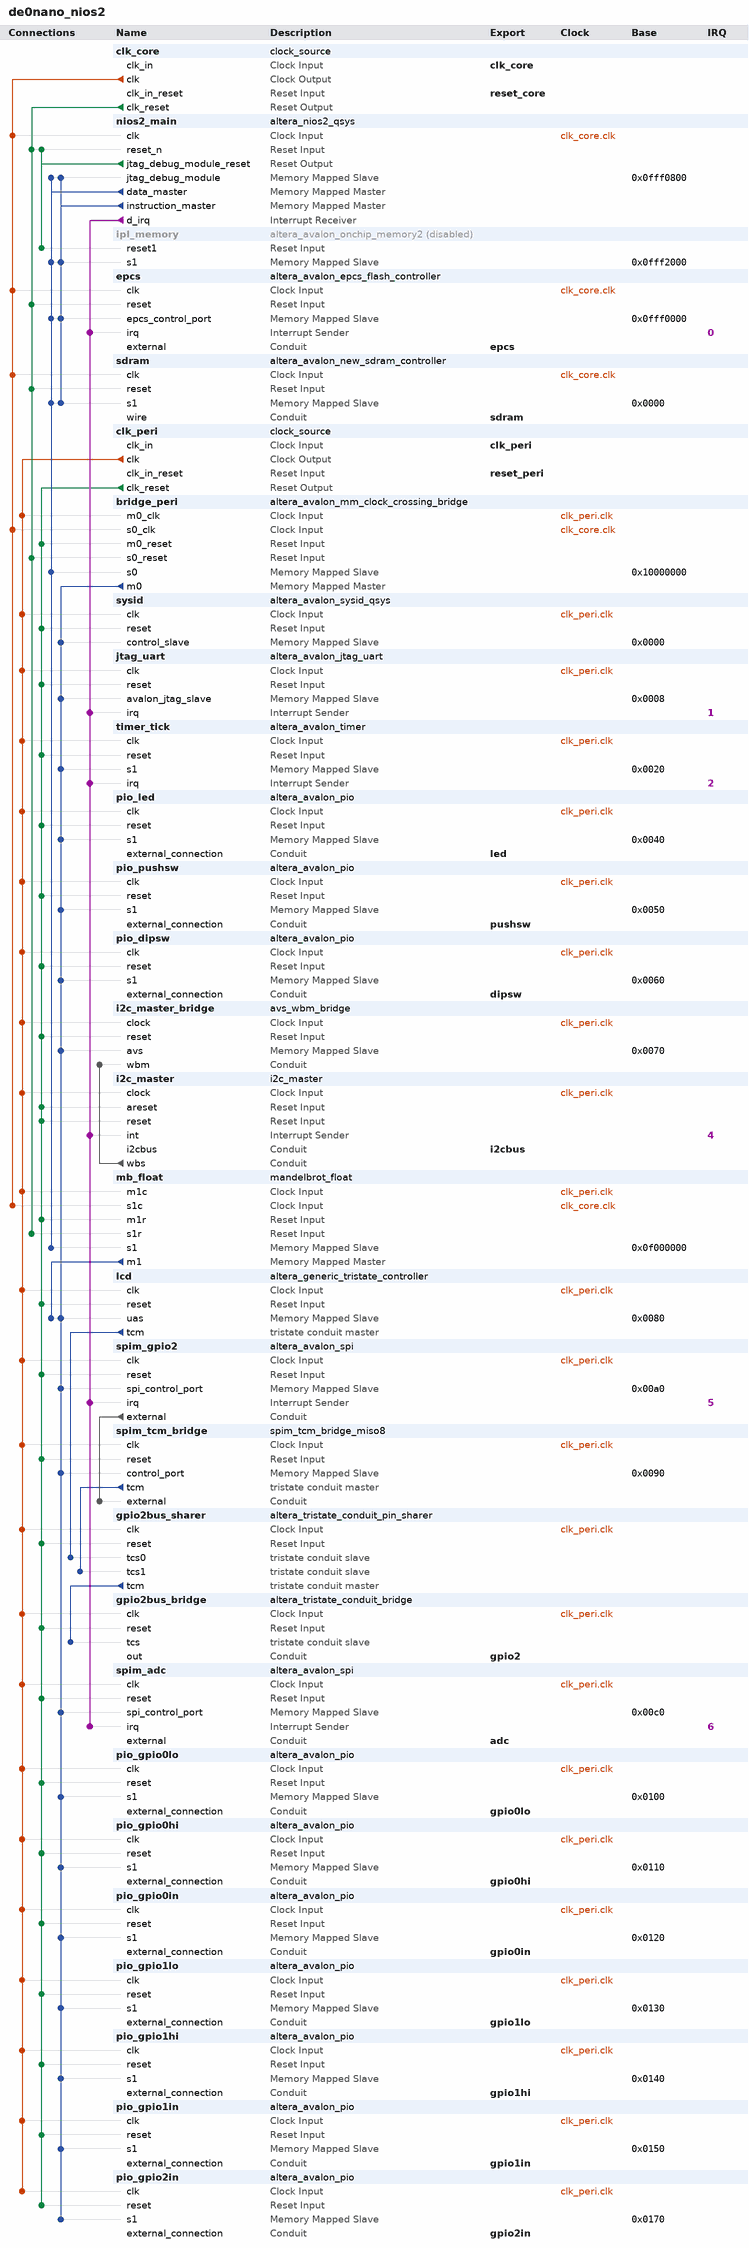
[diagram p0: system contents]
# Platform Designer (Qsys) system de0nano_nios2, Cyclone IV E EP4CE22F17C6
# Parameters at their usual value, and those the tool derives, are not listed.
package require -exact qsys 13.0.1.99.2
create_system de0nano_nios2
set_project_property DEVICE_FAMILY {Cyclone IV E}
set_project_property DEVICE EP4CE22F17C6

add_instance clk_core clock_source 13.0
set_instance_parameter_value clk_core clockFrequency 133333333

add_instance nios2_main altera_nios2_qsys 13.0
set_instance_parameter_value nios2_main resetSlave epcs.epcs_control_port
set_instance_parameter_value nios2_main mmu_TLBMissExcSlave None
set_instance_parameter_value nios2_main exceptionSlave sdram.s1
set_instance_parameter_value nios2_main breakSlave nios2_main.jtag_debug_module
set_instance_parameter_value nios2_main impl Tiny
set_instance_parameter_value nios2_main icache_size 4096

add_instance ipl_memory altera_avalon_onchip_memory2 13.0.1.99.2
set_instance_property ipl_memory ENABLED false
set_instance_parameter_value ipl_memory allowInSystemMemoryContentEditor true
set_instance_parameter_value ipl_memory dataWidth 32
set_instance_parameter_value ipl_memory dualPort false
set_instance_parameter_value ipl_memory initMemContent true
set_instance_parameter_value ipl_memory initializationFileName /home/shuta/projects/shinonome/demo/de0nano_nios2_ipl_memory.hex
set_instance_parameter_value ipl_memory instanceID IPL
set_instance_parameter_value ipl_memory memorySize 8192
set_instance_parameter_value ipl_memory useNonDefaultInitFile true

add_instance epcs altera_avalon_epcs_flash_controller 13.0.1.99.2

add_instance sdram altera_avalon_new_sdram_controller 13.0.1.99.2
set_instance_parameter_value sdram TAC 5.4
set_instance_parameter_value sdram TRCD 18.0
set_instance_parameter_value sdram TRFC 60.0
set_instance_parameter_value sdram TRP 18.0
set_instance_parameter_value sdram casLatency 3
set_instance_parameter_value sdram columnWidth 9
set_instance_parameter_value sdram dataWidth 16
set_instance_parameter_value sdram generateSimulationModel false
set_instance_parameter_value sdram initRefreshCommands 8
set_instance_parameter_value sdram model single_Micron_MT48LC4M32B2_7_chip
set_instance_parameter_value sdram numberOfBanks 4
set_instance_parameter_value sdram numberOfChipSelects 1
set_instance_parameter_value sdram powerUpDelay 200.0
set_instance_parameter_value sdram refreshPeriod 7.8125
set_instance_parameter_value sdram rowWidth 13

add_instance clk_peri clock_source 13.0
set_instance_parameter_value clk_peri clockFrequency 40000000

add_instance bridge_peri altera_avalon_mm_clock_crossing_bridge 13.0
set_instance_parameter_value bridge_peri DATA_WIDTH 32
set_instance_parameter_value bridge_peri ADDRESS_WIDTH 11
set_instance_parameter_value bridge_peri MAX_BURST_SIZE 1
set_instance_parameter_value bridge_peri COMMAND_FIFO_DEPTH 4
set_instance_parameter_value bridge_peri RESPONSE_FIFO_DEPTH 4
set_instance_parameter_value bridge_peri MASTER_SYNC_DEPTH 2
set_instance_parameter_value bridge_peri SLAVE_SYNC_DEPTH 2

add_instance sysid altera_avalon_sysid_qsys 13.0
set_instance_parameter_value sysid id 0

add_instance jtag_uart altera_avalon_jtag_uart 13.0.1.99.2
set_instance_parameter_value jtag_uart simInteractiveOptions NO_INTERACTIVE_WINDOWS

add_instance timer_tick altera_avalon_timer 13.0.1.99.2
set_instance_parameter_value timer_tick alwaysRun true
set_instance_parameter_value timer_tick fixedPeriod true
set_instance_parameter_value timer_tick period 1
set_instance_parameter_value timer_tick periodUnits MSEC
set_instance_parameter_value timer_tick snapshot false

add_instance pio_led altera_avalon_pio 13.0.1.99.2
set_instance_parameter_value pio_led direction Output
set_instance_parameter_value pio_led width 8

add_instance pio_pushsw altera_avalon_pio 13.0.1.99.2
set_instance_parameter_value pio_pushsw direction Input
set_instance_parameter_value pio_pushsw simDoTestBenchWiring true
set_instance_parameter_value pio_pushsw simDrivenValue 3
set_instance_parameter_value pio_pushsw width 2

add_instance pio_dipsw altera_avalon_pio 13.0.1.99.2
set_instance_parameter_value pio_dipsw direction Input
set_instance_parameter_value pio_dipsw simDoTestBenchWiring true
set_instance_parameter_value pio_dipsw simDrivenValue 15
set_instance_parameter_value pio_dipsw width 4

add_instance i2c_master_bridge avs_wbm_bridge 1.0
set_instance_parameter_value i2c_master_bridge ADDR_WIDTH 3
set_instance_parameter_value i2c_master_bridge WORD_WIDTH 8

add_instance i2c_master i2c_master 1.0

add_instance mb_float mandelbrot_float 1.0
set_instance_parameter_value mb_float LCD_BASE 128
set_instance_parameter_value mb_float ITER_WIDTH 8

add_instance lcd altera_generic_tristate_controller 13.0
set_instance_parameter_value lcd TCM_ADDRESS_W 1
set_instance_parameter_value lcd TCM_DATA_W 8
set_instance_parameter_value lcd TCM_BYTEENABLE_W 1
set_instance_parameter_value lcd TCM_READ_WAIT 150
set_instance_parameter_value lcd TCM_WRITE_WAIT 50
set_instance_parameter_value lcd TCM_SETUP_WAIT 25
set_instance_parameter_value lcd TCM_DATA_HOLD 25
set_instance_parameter_value lcd TCM_MAX_PENDING_READ_TRANSACTIONS 1
set_instance_parameter_value lcd TCM_TURNAROUND_TIME 50
set_instance_parameter_value lcd TCM_TIMING_UNITS 0
set_instance_parameter_value lcd TCM_READLATENCY 2
set_instance_parameter_value lcd TCM_SYMBOLS_PER_WORD 1
set_instance_parameter_value lcd USE_READ 1
set_instance_parameter_value lcd USE_BEGINTRANSFER 0
set_instance_parameter_value lcd USE_BYTEENABLE 0
set_instance_parameter_value lcd USE_OUTPUTENABLE 0
set_instance_parameter_value lcd ACTIVE_LOW_READ 1
set_instance_parameter_value lcd ACTIVE_LOW_BYTEENABLE 0
set_instance_parameter_value lcd ACTIVE_LOW_OUTPUTENABLE 0
set_instance_parameter_value lcd ACTIVE_LOW_BEGINTRANSFER 0
set_instance_parameter_value lcd CHIPSELECT_THROUGH_READLATENCY 0
set_instance_parameter_value lcd IS_MEMORY_DEVICE 0
set_instance_parameter_value lcd MODULE_ASSIGNMENT_KEYS embeddedsw.configuration.hwClassnameDriverSupportList
set_instance_parameter_value lcd MODULE_ASSIGNMENT_VALUES "altera_avalon_lan91c111\\,altera_avalon_cfi_flash"

add_instance spim_gpio2 altera_avalon_spi 13.0.1.99.2
set_instance_parameter_value spim_gpio2 clockPolarity 0
set_instance_parameter_value spim_gpio2 dataWidth 8
set_instance_parameter_value spim_gpio2 masterSPI true
set_instance_parameter_value spim_gpio2 numberOfSlaves 1
set_instance_parameter_value spim_gpio2 targetClockRate 1000000

add_instance spim_tcm_bridge spim_tcm_bridge_miso8 1.0
set_instance_parameter_value spim_tcm_bridge SLAVES 1

add_instance gpio2bus_sharer altera_tristate_conduit_pin_sharer 13.0
set_instance_parameter_value gpio2bus_sharer NUM_INTERFACES 2
set_instance_parameter_value gpio2bus_sharer MODULE_ORIGIN_LIST spim_tcm_bridge.tcm,spim_tcm_bridge.tcm,spim_tcm_bridge.tcm,spim_tcm_bridge.tcm,lcd.tcm,lcd.tcm,lcd.tcm,lcd.tcm,lcd.tcm
set_instance_parameter_value gpio2bus_sharer SIGNAL_ORIGIN_LIST ss_n,mosi,sclk,miso,address,read_n,write_n,data,chipselect_n
set_instance_parameter_value gpio2bus_sharer SHARED_SIGNAL_LIST csio_n,addr_mosi,wr_n_sck,data_miso,addr_mosi,rd_n,wr_n_sck,data_miso,cslcd_n

add_instance gpio2bus_bridge altera_tristate_conduit_bridge 13.0

add_instance spim_adc altera_avalon_spi 13.0.1.99.2
set_instance_parameter_value spim_adc clockPolarity 0
set_instance_parameter_value spim_adc dataWidth 8
set_instance_parameter_value spim_adc masterSPI true
set_instance_parameter_value spim_adc numberOfSlaves 1
set_instance_parameter_value spim_adc targetClockRate 2000000

add_instance pio_gpio0lo altera_avalon_pio 13.0.1.99.2
set_instance_parameter_value pio_gpio0lo direction Bidir
set_instance_parameter_value pio_gpio0lo width 32

add_instance pio_gpio0hi altera_avalon_pio 13.0.1.99.2
set_instance_parameter_value pio_gpio0hi direction Bidir
set_instance_parameter_value pio_gpio0hi width 2

add_instance pio_gpio0in altera_avalon_pio 13.0.1.99.2
set_instance_parameter_value pio_gpio0in direction Input
set_instance_parameter_value pio_gpio0in width 2

add_instance pio_gpio1lo altera_avalon_pio 13.0.1.99.2
set_instance_parameter_value pio_gpio1lo direction Bidir
set_instance_parameter_value pio_gpio1lo width 32

add_instance pio_gpio1hi altera_avalon_pio 13.0.1.99.2
set_instance_parameter_value pio_gpio1hi direction Bidir
set_instance_parameter_value pio_gpio1hi width 2

add_instance pio_gpio1in altera_avalon_pio 13.0.1.99.2
set_instance_parameter_value pio_gpio1in direction Input
set_instance_parameter_value pio_gpio1in width 2

add_instance pio_gpio2in altera_avalon_pio 13.0.1.99.2
set_instance_parameter_value pio_gpio2in direction Input
set_instance_parameter_value pio_gpio2in width 3

# connections
add_connection clk_core.clk bridge_peri.s0_clk clock
add_connection clk_core.clk epcs.clk clock
add_connection clk_core.clk mb_float.s1c clock
add_connection clk_core.clk nios2_main.clk clock
add_connection clk_core.clk sdram.clk clock
add_connection clk_peri.clk bridge_peri.m0_clk clock
add_connection clk_peri.clk gpio2bus_bridge.clk clock
add_connection clk_peri.clk gpio2bus_sharer.clk clock
add_connection clk_peri.clk i2c_master.clock clock
add_connection clk_peri.clk i2c_master_bridge.clock clock
add_connection clk_peri.clk jtag_uart.clk clock
add_connection clk_peri.clk lcd.clk clock
add_connection clk_peri.clk mb_float.m1c clock
add_connection clk_peri.clk pio_dipsw.clk clock
add_connection clk_peri.clk pio_gpio0hi.clk clock
add_connection clk_peri.clk pio_gpio0in.clk clock
add_connection clk_peri.clk pio_gpio0lo.clk clock
add_connection clk_peri.clk pio_gpio1hi.clk clock
add_connection clk_peri.clk pio_gpio1in.clk clock
add_connection clk_peri.clk pio_gpio1lo.clk clock
add_connection clk_peri.clk pio_gpio2in.clk clock
add_connection clk_peri.clk pio_led.clk clock
add_connection clk_peri.clk pio_pushsw.clk clock
add_connection clk_peri.clk spim_adc.clk clock
add_connection clk_peri.clk spim_gpio2.clk clock
add_connection clk_peri.clk spim_tcm_bridge.clk clock
add_connection clk_peri.clk sysid.clk clock
add_connection clk_peri.clk timer_tick.clk clock
add_connection clk_core.clk_reset bridge_peri.s0_reset reset
add_connection clk_core.clk_reset epcs.reset reset
add_connection clk_core.clk_reset mb_float.s1r reset
add_connection clk_core.clk_reset nios2_main.reset_n reset
add_connection clk_core.clk_reset sdram.reset reset
add_connection clk_peri.clk_reset bridge_peri.m0_reset reset
add_connection clk_peri.clk_reset gpio2bus_bridge.reset reset
add_connection clk_peri.clk_reset gpio2bus_sharer.reset reset
add_connection clk_peri.clk_reset i2c_master.areset reset
add_connection clk_peri.clk_reset i2c_master.reset reset
add_connection clk_peri.clk_reset i2c_master_bridge.reset reset
add_connection clk_peri.clk_reset jtag_uart.reset reset
add_connection clk_peri.clk_reset lcd.reset reset
add_connection clk_peri.clk_reset mb_float.m1r reset
add_connection clk_peri.clk_reset pio_dipsw.reset reset
add_connection clk_peri.clk_reset pio_gpio0hi.reset reset
add_connection clk_peri.clk_reset pio_gpio0in.reset reset
add_connection clk_peri.clk_reset pio_gpio0lo.reset reset
add_connection clk_peri.clk_reset pio_gpio1hi.reset reset
add_connection clk_peri.clk_reset pio_gpio1in.reset reset
add_connection clk_peri.clk_reset pio_gpio1lo.reset reset
add_connection clk_peri.clk_reset pio_gpio2in.reset reset
add_connection clk_peri.clk_reset pio_led.reset reset
add_connection clk_peri.clk_reset pio_pushsw.reset reset
add_connection clk_peri.clk_reset spim_adc.reset reset
add_connection clk_peri.clk_reset spim_gpio2.reset reset
add_connection clk_peri.clk_reset spim_tcm_bridge.reset reset
add_connection clk_peri.clk_reset sysid.reset reset
add_connection clk_peri.clk_reset timer_tick.reset reset
add_connection nios2_main.jtag_debug_module_reset ipl_memory.reset1 reset
add_connection nios2_main.jtag_debug_module_reset nios2_main.reset_n reset
add_connection bridge_peri.m0 i2c_master_bridge.avs avalon
set_connection_parameter_value bridge_peri.m0/i2c_master_bridge.avs baseAddress 0x0070
add_connection bridge_peri.m0 jtag_uart.avalon_jtag_slave avalon
set_connection_parameter_value bridge_peri.m0/jtag_uart.avalon_jtag_slave baseAddress 0x0008
add_connection bridge_peri.m0 lcd.uas avalon
set_connection_parameter_value bridge_peri.m0/lcd.uas baseAddress 0x0080
add_connection bridge_peri.m0 pio_dipsw.s1 avalon
set_connection_parameter_value bridge_peri.m0/pio_dipsw.s1 baseAddress 0x0060
add_connection bridge_peri.m0 pio_gpio0hi.s1 avalon
set_connection_parameter_value bridge_peri.m0/pio_gpio0hi.s1 baseAddress 0x0110
add_connection bridge_peri.m0 pio_gpio0in.s1 avalon
set_connection_parameter_value bridge_peri.m0/pio_gpio0in.s1 baseAddress 0x0120
add_connection bridge_peri.m0 pio_gpio0lo.s1 avalon
set_connection_parameter_value bridge_peri.m0/pio_gpio0lo.s1 baseAddress 0x0100
add_connection bridge_peri.m0 pio_gpio1hi.s1 avalon
set_connection_parameter_value bridge_peri.m0/pio_gpio1hi.s1 baseAddress 0x0140
add_connection bridge_peri.m0 pio_gpio1in.s1 avalon
set_connection_parameter_value bridge_peri.m0/pio_gpio1in.s1 baseAddress 0x0150
add_connection bridge_peri.m0 pio_gpio1lo.s1 avalon
set_connection_parameter_value bridge_peri.m0/pio_gpio1lo.s1 baseAddress 0x0130
add_connection bridge_peri.m0 pio_gpio2in.s1 avalon
set_connection_parameter_value bridge_peri.m0/pio_gpio2in.s1 baseAddress 0x0170
add_connection bridge_peri.m0 pio_led.s1 avalon
set_connection_parameter_value bridge_peri.m0/pio_led.s1 baseAddress 0x0040
add_connection bridge_peri.m0 pio_pushsw.s1 avalon
set_connection_parameter_value bridge_peri.m0/pio_pushsw.s1 baseAddress 0x0050
add_connection bridge_peri.m0 spim_adc.spi_control_port avalon
set_connection_parameter_value bridge_peri.m0/spim_adc.spi_control_port baseAddress 0x00c0
add_connection bridge_peri.m0 spim_gpio2.spi_control_port avalon
set_connection_parameter_value bridge_peri.m0/spim_gpio2.spi_control_port baseAddress 0x00a0
add_connection bridge_peri.m0 spim_tcm_bridge.control_port avalon
set_connection_parameter_value bridge_peri.m0/spim_tcm_bridge.control_port baseAddress 0x0090
add_connection bridge_peri.m0 sysid.control_slave avalon
set_connection_parameter_value bridge_peri.m0/sysid.control_slave baseAddress 0x0000
add_connection bridge_peri.m0 timer_tick.s1 avalon
set_connection_parameter_value bridge_peri.m0/timer_tick.s1 baseAddress 0x0020
add_connection mb_float.m1 lcd.uas avalon
set_connection_parameter_value mb_float.m1/lcd.uas baseAddress 0x0080
add_connection nios2_main.data_master bridge_peri.s0 avalon
set_connection_parameter_value nios2_main.data_master/bridge_peri.s0 baseAddress 0x10000000
add_connection nios2_main.data_master epcs.epcs_control_port avalon
set_connection_parameter_value nios2_main.data_master/epcs.epcs_control_port baseAddress 0x0fff0000
add_connection nios2_main.data_master ipl_memory.s1 avalon
set_connection_parameter_value nios2_main.data_master/ipl_memory.s1 baseAddress 0x0fff2000
add_connection nios2_main.data_master mb_float.s1 avalon
set_connection_parameter_value nios2_main.data_master/mb_float.s1 baseAddress 0x0f000000
add_connection nios2_main.data_master nios2_main.jtag_debug_module avalon
set_connection_parameter_value nios2_main.data_master/nios2_main.jtag_debug_module baseAddress 0x0fff0800
add_connection nios2_main.data_master sdram.s1 avalon
set_connection_parameter_value nios2_main.data_master/sdram.s1 baseAddress 0x0000
add_connection nios2_main.instruction_master epcs.epcs_control_port avalon
set_connection_parameter_value nios2_main.instruction_master/epcs.epcs_control_port baseAddress 0x0fff0000
add_connection nios2_main.instruction_master ipl_memory.s1 avalon
set_connection_parameter_value nios2_main.instruction_master/ipl_memory.s1 baseAddress 0x0fff2000
add_connection nios2_main.instruction_master nios2_main.jtag_debug_module avalon
set_connection_parameter_value nios2_main.instruction_master/nios2_main.jtag_debug_module baseAddress 0x0fff0800
add_connection nios2_main.instruction_master sdram.s1 avalon
set_connection_parameter_value nios2_main.instruction_master/sdram.s1 baseAddress 0x0000
add_connection i2c_master.wbs i2c_master_bridge.wbm conduit
add_connection spim_gpio2.external spim_tcm_bridge.external conduit
add_connection nios2_main.d_irq epcs.irq interrupt
set_connection_parameter_value nios2_main.d_irq/epcs.irq irqNumber 0
add_connection nios2_main.d_irq i2c_master.int interrupt
set_connection_parameter_value nios2_main.d_irq/i2c_master.int irqNumber 4
add_connection nios2_main.d_irq jtag_uart.irq interrupt
set_connection_parameter_value nios2_main.d_irq/jtag_uart.irq irqNumber 1
add_connection nios2_main.d_irq spim_adc.irq interrupt
set_connection_parameter_value nios2_main.d_irq/spim_adc.irq irqNumber 6
add_connection nios2_main.d_irq spim_gpio2.irq interrupt
set_connection_parameter_value nios2_main.d_irq/spim_gpio2.irq irqNumber 5
add_connection nios2_main.d_irq timer_tick.irq interrupt
set_connection_parameter_value nios2_main.d_irq/timer_tick.irq irqNumber 2
add_connection gpio2bus_sharer.tcm gpio2bus_bridge.tcs tristate_conduit
add_connection lcd.tcm gpio2bus_sharer.tcs0 tristate_conduit
add_connection spim_tcm_bridge.tcm gpio2bus_sharer.tcs1 tristate_conduit

# exported interfaces
add_interface epcs conduit end
set_interface_property epcs EXPORT_OF epcs.external
add_interface sdram conduit end
set_interface_property sdram EXPORT_OF sdram.wire
add_interface led conduit end
set_interface_property led EXPORT_OF pio_led.external_connection
add_interface pushsw conduit end
set_interface_property pushsw EXPORT_OF pio_pushsw.external_connection
add_interface dipsw conduit end
set_interface_property dipsw EXPORT_OF pio_dipsw.external_connection
add_interface i2cbus conduit end
set_interface_property i2cbus EXPORT_OF i2c_master.i2cbus
add_interface clk_core clock sink
set_interface_property clk_core EXPORT_OF clk_core.clk_in
add_interface reset_core reset sink
set_interface_property reset_core EXPORT_OF clk_core.clk_in_reset
add_interface clk_peri clock sink
set_interface_property clk_peri EXPORT_OF clk_peri.clk_in
add_interface reset_peri reset sink
set_interface_property reset_peri EXPORT_OF clk_peri.clk_in_reset
add_interface gpio2 conduit end
set_interface_property gpio2 EXPORT_OF gpio2bus_bridge.out
add_interface adc conduit end
set_interface_property adc EXPORT_OF spim_adc.external
add_interface gpio2in conduit end
set_interface_property gpio2in EXPORT_OF pio_gpio2in.external_connection
add_interface gpio0lo conduit end
set_interface_property gpio0lo EXPORT_OF pio_gpio0lo.external_connection
add_interface gpio0hi conduit end
set_interface_property gpio0hi EXPORT_OF pio_gpio0hi.external_connection
add_interface gpio0in conduit end
set_interface_property gpio0in EXPORT_OF pio_gpio0in.external_connection
add_interface gpio1lo conduit end
set_interface_property gpio1lo EXPORT_OF pio_gpio1lo.external_connection
add_interface gpio1hi conduit end
set_interface_property gpio1hi EXPORT_OF pio_gpio1hi.external_connection
add_interface gpio1in conduit end
set_interface_property gpio1in EXPORT_OF pio_gpio1in.external_connection

set_interconnect_requirement {$system} qsys_mm.clockCrossingAdapter HANDSHAKE
set_interconnect_requirement {$system} qsys_mm.maxAdditionalLatency 1

save_system de0nano_nios2.qsys
